# Altium schematic sheet SERVO_DRIVER.SchDoc
size B
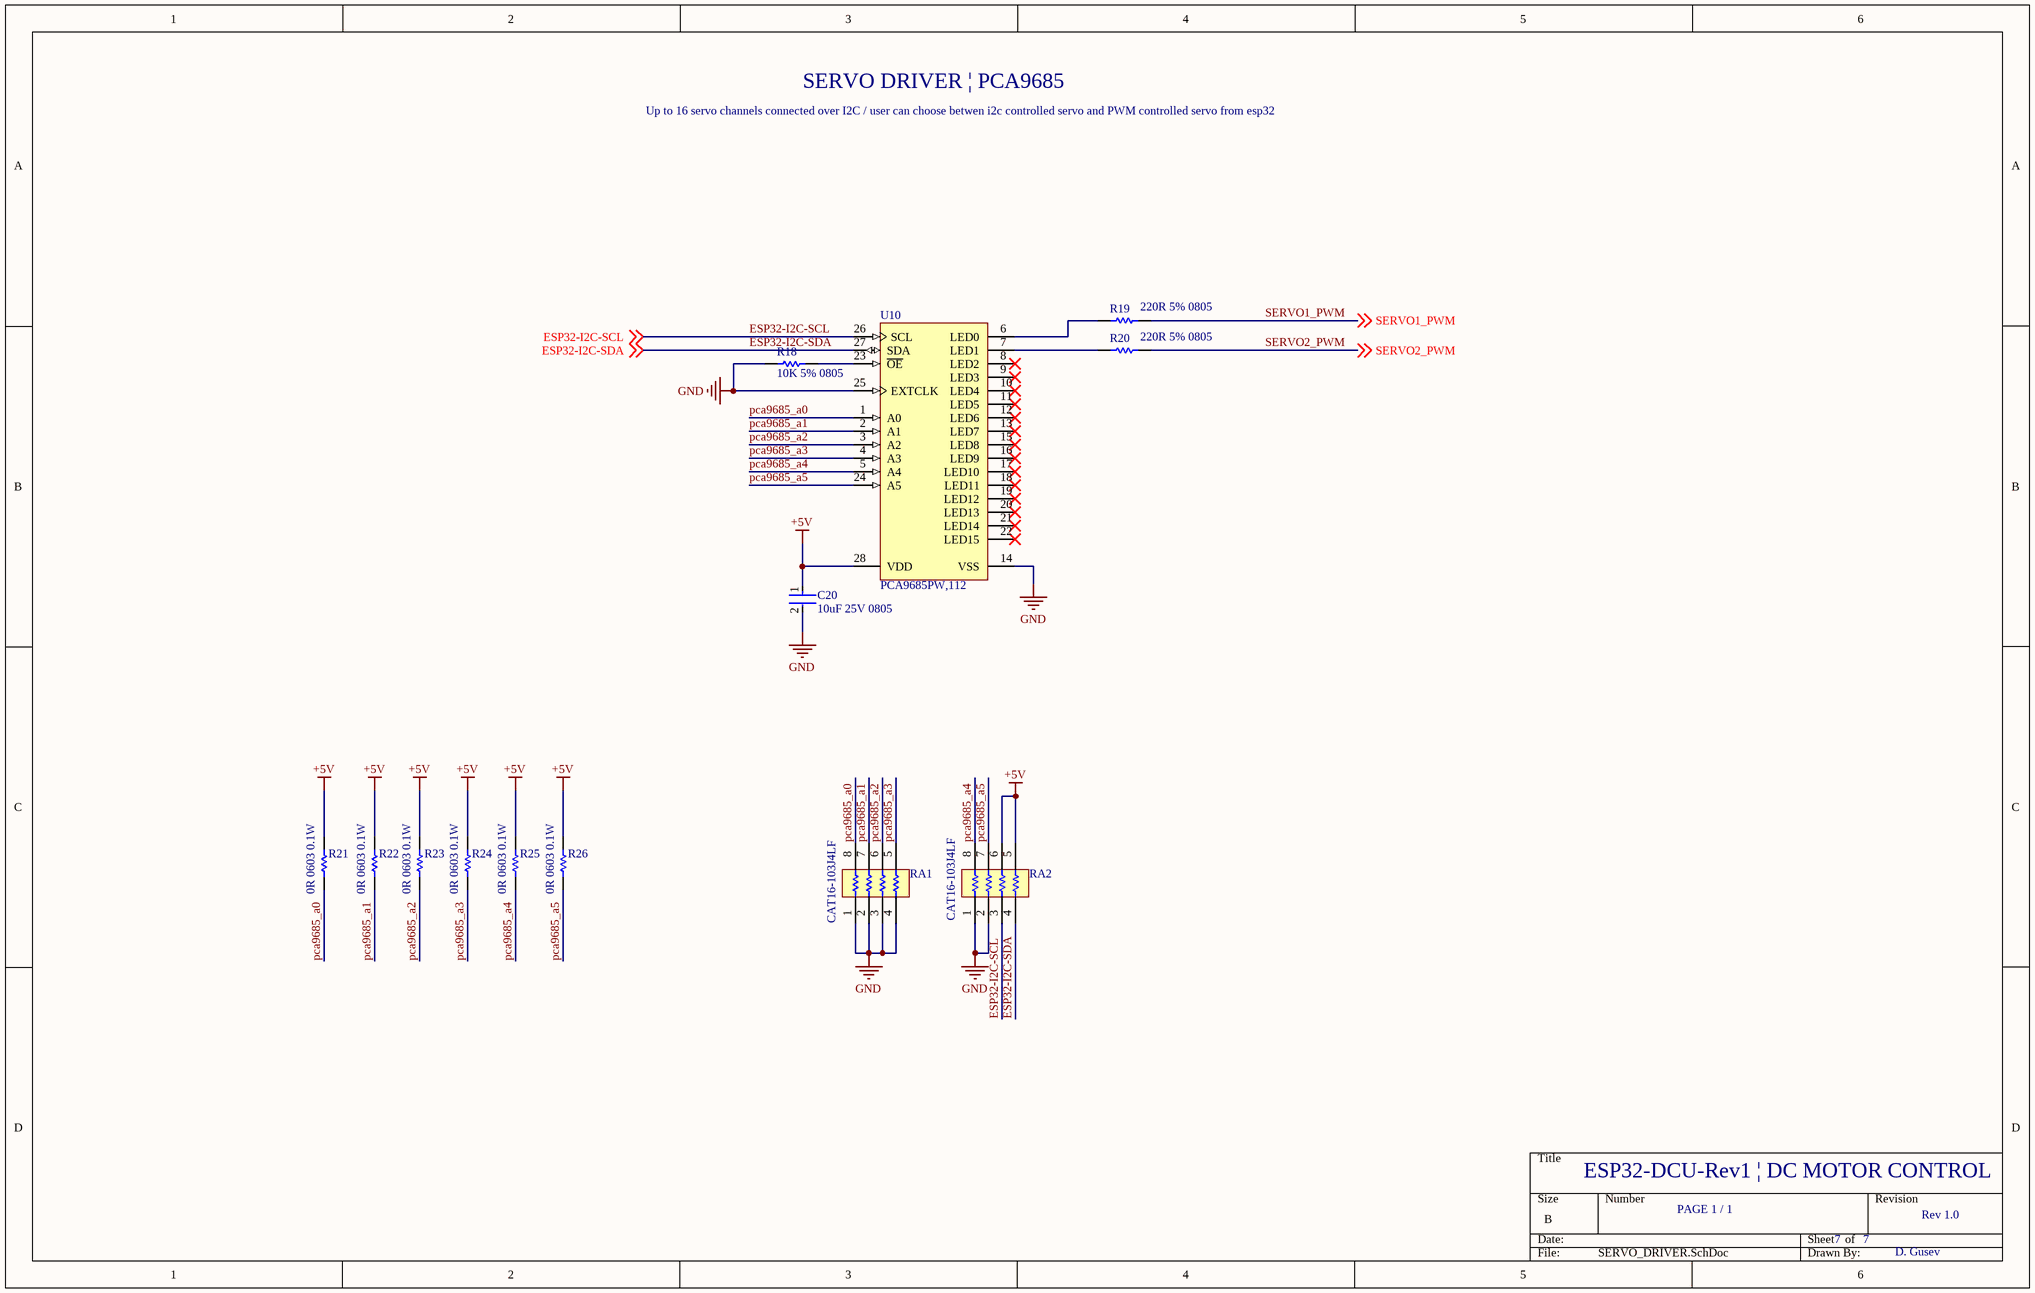
[diagram p0: SERVO_DRIVER.SchDoc]

## Parts
C20  10uF 25V 0805  [FP-GRM21B-0_15-IPC_C]
R18  10K 5% 0805  [RESC2013X60X35NL10T20]
R19  220R 5% 0805  [RESC2013X60X40NL20T25]
R20  220R 5% 0805  [RESC2013X60X40NL20T25]
R21  0R 0603 0.1W  [RESC1608X55X25ML10T15]
R22  0R 0603 0.1W  [RESC1608X55X25ML10T15]
R23  0R 0603 0.1W  [RESC1608X55X25ML10T15]
R24  0R 0603 0.1W  [RESC1608X55X25ML10T15]
R25  0R 0603 0.1W  [RESC1608X55X25ML10T15]
R26  0R 0603 0.1W  [RESC1608X55X25ML10T15]
RA1  CAT16-103J4LF  [BOUR-CAT16-103J4LF_L]
RA2  CAT16-103J4LF  [BOUR-CAT16-103J4LF_L]
U10  PCA9685PW,112  [SOT361-1_V]

## Nets
+5V: C20.1 R21.2 R22.2 R23.2 R24.2 R25.2 R26.2 RA2.5 RA2.6 U10.28(VDD)
GND: C20.2 R18.2 RA1.1 RA1.2 RA1.3 RA1.4 RA2.1 RA2.2 U10.14(VSS) U10.25(EXTCLK)
ESP32-I2C-SCL: RA2.3 U10.26(SCL) ; off-sheet ESP32-I2C-SCL
ESP32-I2C-SDA: RA2.4 U10.27(SDA) ; off-sheet ESP32-I2C-SDA
pca9685_a0: R21.1 RA1.8 U10.1(A0)
pca9685_a1: R22.1 RA1.7 U10.2(A1)
pca9685_a2: R23.1 RA1.6 U10.3(A2)
pca9685_a3: R24.1 RA1.5 U10.4(A3)
pca9685_a4: R25.1 RA2.8 U10.5(A4)
pca9685_a5: R26.1 RA2.7 U10.24(A5)
SERVO1_PWM: R19.2 ; off-sheet SERVO1_PWM
SERVO2_PWM: R20.2 ; off-sheet SERVO2_PWM
NetR18_1: R18.1 U10.23(~{OE})
NetR19_1: R19.1 U10.6(LED0)
NetR20_1: R20.1 U10.7(LED1)

Not connected (* = marked no-connect by the designer): U10 8(LED2)* 9(LED3)* 10(LED4)* 11(LED5)* 12(LED6)* 13(LED7)* 15(LED8)* 16(LED9)* 17(LED10)* 18(LED11)* 19(LED12)* 20(LED13)* 21(LED14)* 22(LED15)*

## Notes on the sheet
- SERVO DRIVER | PCA9685
- Up to 16 servo channels connected over I2C / user can choose betwen i2c controlled servo and PWM controlled servo from esp32
- ESP32-DCU-Rev1 | DC MOTOR CONTROL
- PAGE 1 / 1
- 7
- Rev 1.0
- D. Gusev

## Library data of the parts
C20 = CMP-2007-03541-2: Chip Multilayer Ceramic Capacitors for General Purpose, 0805, 10uF, X5R, 15%, 10%, 25V; Length: 2mm; Depth: 1.25mm; Termination: SMD/SMT; Voltage: 25V; Height: 1.25mm; Material: Ceramic; Thickness: 0.053inch; Radiation Hardening: No; Min Operating Temperature: -55°C; Width: 0.049inch; Package Quantity: 1; Mount: Surface Mount; Dielectric: X5R; Packaging: Tape and Reel; Capacitance: 10uF; Voltage Rating (DC): 25V; Lead Free: Lead Free; Max Operating Temperature: 85°C; Case Code (Imperial): 0805; Case/Package: 0805; Tolerance: 10%; Voltage Rating: 25V; Case Code (Metric): 2012
R18 = CMP-1659-00013-4: Chip Resistor, 10 KOhm, +/- 1%, 0.125 W, -55 to 155 degC, 0805 (2012 Metric), RoHS, Tape and Reel; Manufacturer: Yageo; Voltage Rating: 150 V; Mount: Surface Mount; ComponentLink1Description: Manufacturer URL; ComponentLink2URL: http://www.yageo.com/documents/recent/PYu-RC_Group_51_RoHS_L_04.pdf; Pins: 2; Length: 2 mm; Min Operating Temperature: -55 degC; Height: 0.5 mm; Mounting Technology: Surface Mount; RoHSCompliant: true; REACH SVHC: No SVHC; ComponentLink1URL: http://www.yageo.com/; Max Operating Temperature: 155 degC; PackageReference: 0805; DatasheetVersion: Rev. 4, 02/2016; Package Quantity: 5000; Packaging: Tape and Reel; ComponentLink2Description: Datasheet; PackageDescription: 2-Pin Surface Mounted Device, Body 2 x 1.25 mm
R19 R20 = CMP-2001-00612-1: Manufacturer: Panasonic; Part Number: ERA6AEB221V
R21-R26 = CMP-2100-03667-1: Chip Resistor, 0 Ohm, +/- 5%, 0.1 W, -55 to 155 degC, 0603 (1608 Metric), RoHS, Tape and Reel; Manufacturer: Yageo; Temperature Coefficient: 200ppm/degreesC; Voltage Rating: 50V; Power Rating: 100mW; Resistance: 0mOhm; Width: 0.8mm; Max Operating Temperature: 155degC; Tolerance: 5%; Package Reference: 0603; Height: 0.45mm; Depth: 0.8mm; Package Description: 2-Pin Surface Mount Device, Body 1.6 x 0.8 mm; Termination: SMD/SMT; Package Quantity: 5000; Case/Package: 0603; Case Code (Imperial): 0603; Radiation Hardening: No; Number of Pins: 2; Length: 1.6mm; Lead Free: LeadFree; Voltage Rating (DC): 50V; Military Standard: Not; Datasheet URL: http://www.yageo.com/NewPortal/yageodocoutput?fileName=/pdf/R-Chip/PYu-RC_Group_51_RoHS_L_5.pdf; Manufacturer URL: http://www.yageo.com/; Packaging: TapeandReel; Case Code (Metric): 1608; Min Operating Temperature: -55degC; Composition: ThickFilm; RoHSCompliant: true; Contact Plating: Tin; Datasheet Version: Rev. 5, 10/2016; REACH SVHC: NoSVHC
RA1 RA2 = CMP-2000-06067-1: CAT / CAY 16 Series - Chip Resistor Array, 10 KOhm, +/- 5%, 50 V, -55 to 125 degC, 8-Pin SMD, RoHS, Tape and Reel; Manufacturer: Bourns; Power Per Element: 62.5mW; Online Catalog: CAT16Series; Resistance (Ohms): 10k; Number of Resistors: 4; EDA / CAD Models: DownloadfromAcceleratedDesigns; Temperature Coefficient: ±200ppm/°C; Circuit Type: Isolated; Other Names: CAT16-103J4LFDKR; Package Reference: CAT16-103J4LF; Datasheet Version: 09/2014; Series: CAT16; Manufacturer URL: http://www.bourns.com/; Mounting Type: SurfaceMount; Datasheet URL: http://www.mouser.com/ds/2/54/ATCAY-777361.pdf; Category: Resistors; Height: 0.024"(0.60mm); Mounting Technology: SurfaceMount; Applications: -; Size / Dimension: 0.126"Lx0.061"W(3.20mmx1.55mm); Packaging: Digi-Reel®; Package / Case: 1206(3216Metric),Concave,LongSideTerminals; Supplier Device Package: 1206; RoHS Information: CAT16MaterialDeclaration; Number of Pins: 8; Family: ResistorNetworks,Arrays; Standard Package: 1; Package Description: 8-Pin Surface Mount Device, Body 3.2 x 1.55 mm, Pitch 0.8 mm; Operating Temperature: -55°C~125°C; Tolerance: ±5%
U10 = CMP-1595-00004-2: 16-Channel, 12-Bit PWM Fm+ I2C-Bus LED Controller, 2.3 to 5.5 V, -40 to 85 degC, 28-Pin TSSOP (SOT361-1), RoHS, Tape and Reel; Supply Current Max: 10 mA; Supply Voltage Min: 2.3 V; Supply Voltage Max: 5.5 V; Frequency: 25000000 Hz; Temperature Min: -40 degC; PackageDescription: 28-Pin Small Outline Package, Body 9.7 x 4.4 mm, Pitch 0.65 mm; RoHS: TRUE; ComponentLink1Description: Manufacturer URL; Code_JEDEC: MO-153; PartNumber: PCA9685; ComponentLink2URL: http://www.nxp.com/documents/data_sheet/PCA9685.pdf; Packing: Tape and Reel; ComponentLink1URL: http://www.nxp.com/; ComponentLink3Description: Package Specification; ComponentLink2Description: Datasheet; ComponentLink3URL: http://www.nxp.com/documents/outline_drawing/sot361-1_po.pdf; DatasheetVersion: Rev. 4; Temperature Max: 85 degC; PackageVersion: 02/2003; Mounting Technology: Surface Mount